# Altium schematic sheet Schema_antenne.SchDoc
size A4; Revision: V0.1 Rev A; SheetNumber: 8; SheetTotal: 9
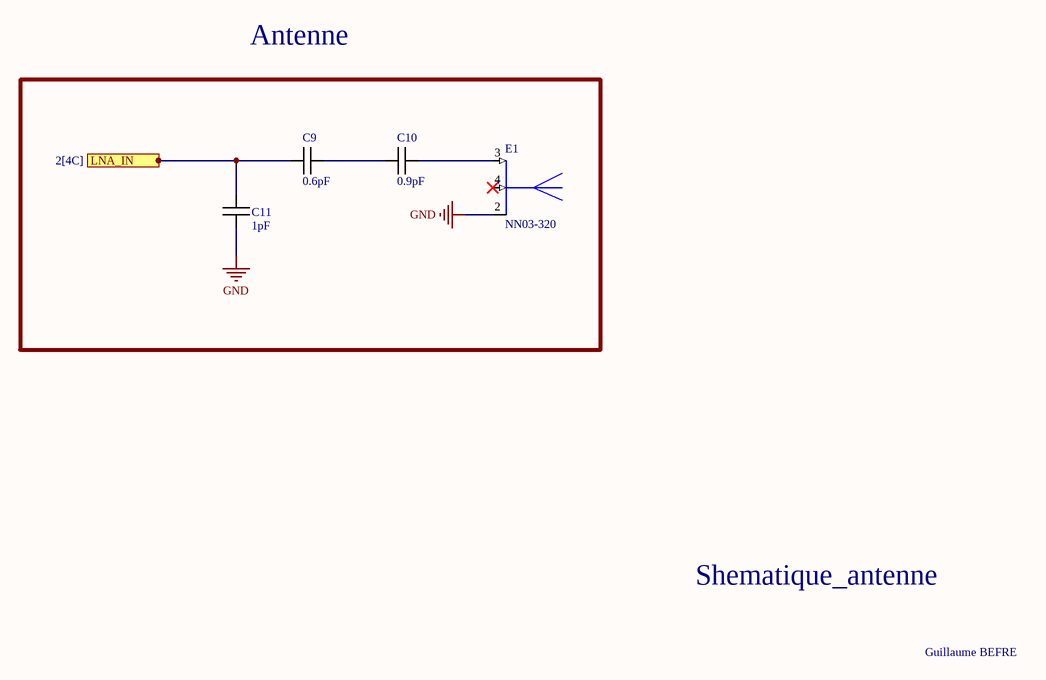
[diagram p0: Schema_antenne.SchDoc]

## Parts
C9  0.6pF  [CAPC1005X06N]
C10  0.9pF  [CAPC1005X06N]
C11  1pF  [CAPC1005X06N]
E1  NN03-320  [XCVR_NN03-320]

## Ports
LNA_IN (out, see 2[4C])

## Nets
GND: C11.2 E1.2(GROUND)
LNA_IN: C9.2 C11.1 ; port LNA_IN
NetC9_1: C9.1 C10.2
NetC10_1: C10.1 E1.3(FEED_BLUETOOTH)

Not connected (* = marked no-connect by the designer): E1 4(FEED_GNSS)*

## Notes on the sheet
- Antenne
- Shematique_antenne
- Guillaume BEFRE

## Library data of the parts
C9-C11 = Capacitor
E1 = NN03-320: Dual port antenna booster for GNSS, Bluetooth, 5G and UWB (1561 - 1606MHz, 2400 - 2500MHz, 3400 - 3800MHz, 3100 - 4800MHz and 6000 - 10600 MHz), signal booster; Manufacturer_Name: Ignion; Manufacturer_Part_Number: NN03-320; Mouser Part Number: 128-NN03-320